# Altium schematic sheet GALX4-0047N_PCB-1109N_REV-A_LCD.SchDoc
size 431 x 279 mm; SheetNumber: 1; SheetTotal: 1; DocumentName: Sheet1.SCHDOC
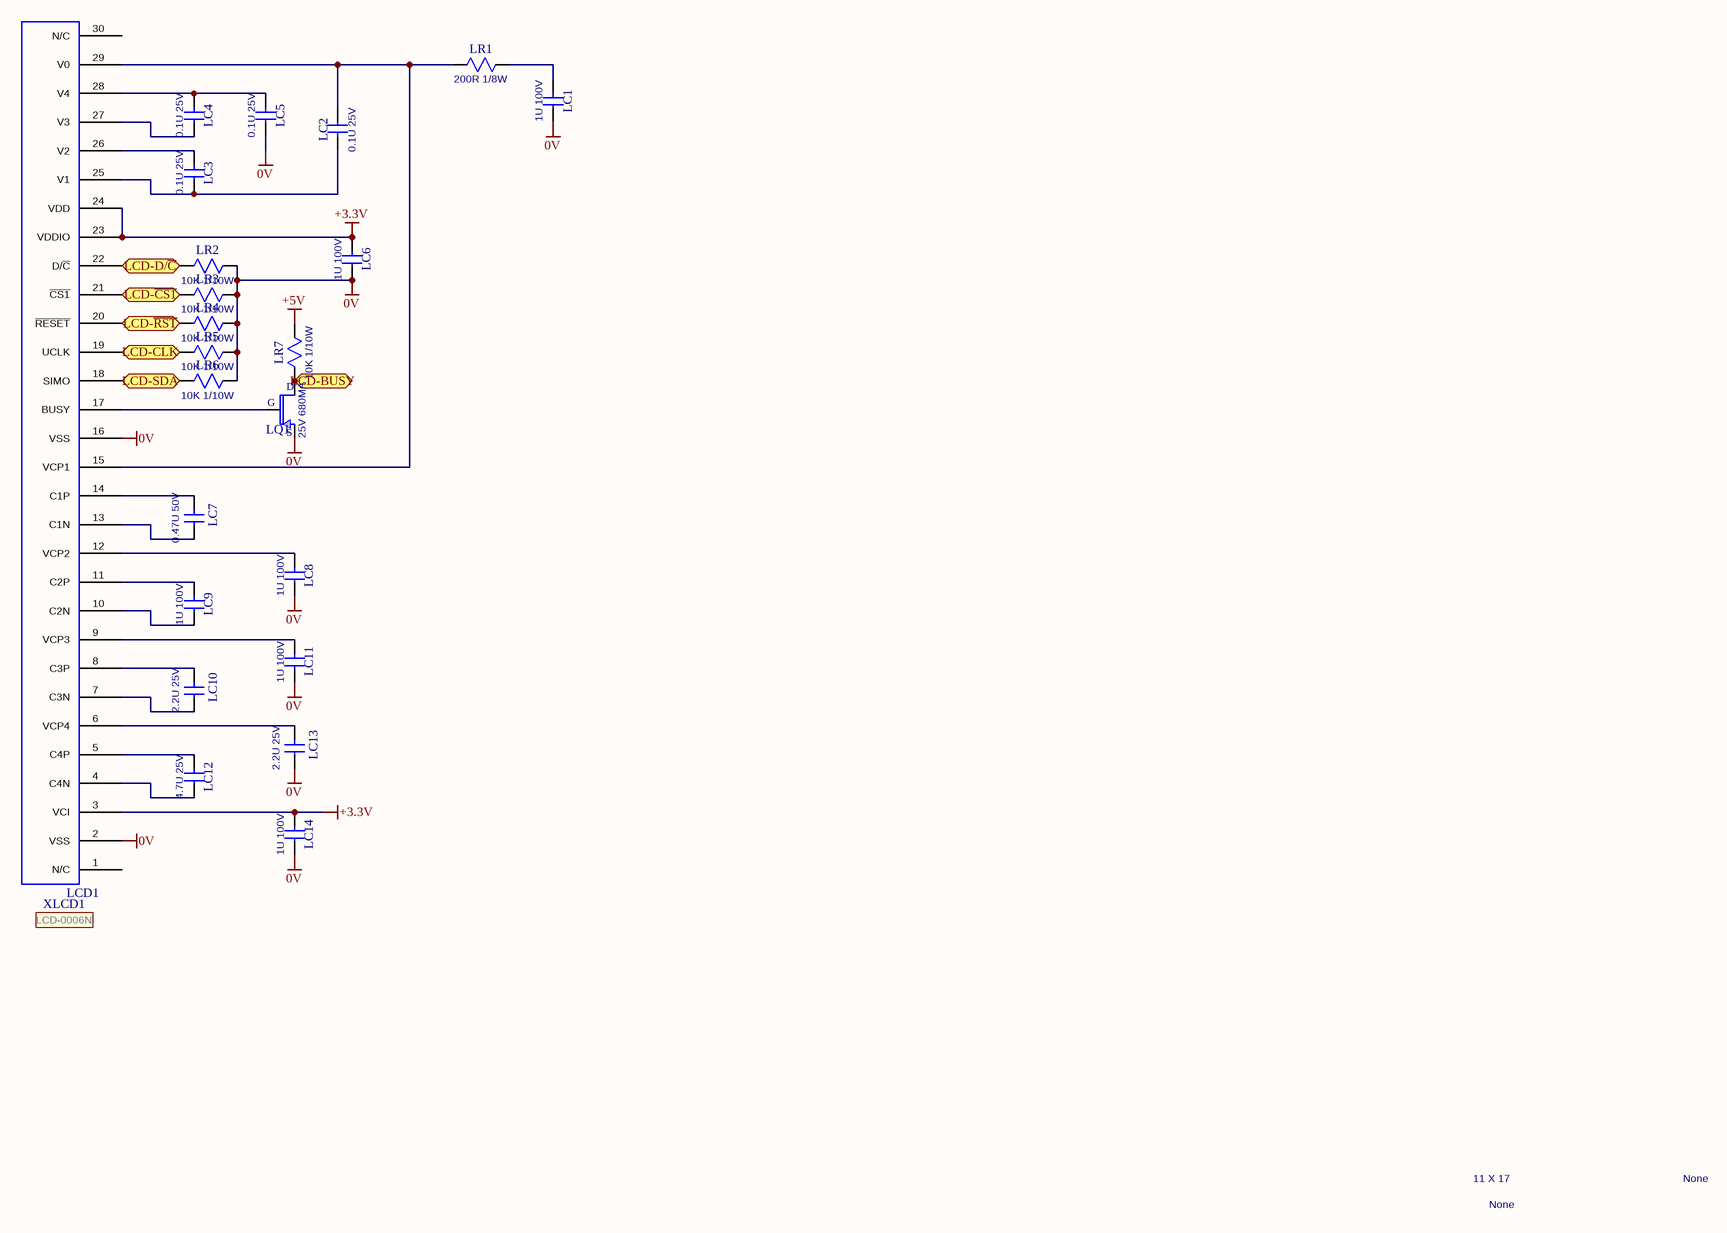
[diagram p0: GALX4-0047N_PCB-1109N_REV-A_LCD.SchDoc]

## Parts
LC1  value 1U 100V  [1206]  (hidden comment: CAP-0110N)
LC2  value 0.1U 25V  [0603]  (hidden comment: CAP-0112N)
LC3  value 0.1U 25V  [0603]  (hidden comment: CAP-0112N)
LC4  value 0.1U 25V  [0603]  (hidden comment: CAP-0112N)
LC5  value 0.1U 25V  [0603]  (hidden comment: CAP-0112N)
LC6  value 1U 100V  [1206]  (hidden comment: CAP-0110N)
LC7  value 0.47U 50V  [0805]  (hidden comment: CAP-0123N)
LC8  value 1U 100V  [1206]  (hidden comment: CAP-0110N)
LC9  value 1U 100V  [1206]  (hidden comment: CAP-0110N)
LC10  value 2.2U 25V  [0805]  (hidden comment: CAP-0124N)
LC11  value 1U 100V  [1206]  (hidden comment: CAP-0110N)
LC12  value 4.7U 25V  [0805]  (hidden comment: CAP-0098N)
LC13  value 2.2U 25V  [0805]  (hidden comment: CAP-0124N)
LC14  value 1U 100V  [1206]  (hidden comment: CAP-0110N)
LCD1  CONN-0278N  [LCD-KENT-120X33-NOTIT]  (value not drawn)
LQ1  value 25V 680MA  [SOT-23]  (hidden comment: XTOR-0020N)
LR1  value 200R 1/8W  [0805]  (hidden comment: RES-0332N)
LR2  value 10K 1/10W  [0603]  (hidden comment: RES-0314N)
LR3  value 10K 1/10W  [0603]  (hidden comment: RES-0314N)
LR4  value 10K 1/10W  [0603]  (hidden comment: RES-0314N)
LR5  value 10K 1/10W  [0603]  (hidden comment: RES-0314N)
LR6  value 10K 1/10W  [0603]  (hidden comment: RES-0314N)
LR7  value 10K 1/10W  [0603]  (hidden comment: RES-0314N)
XLCD1  LCD-0006N  (mechanical)

## Ports
LCD-BUSY (bidir), LCD-CLK (bidir), LCD-D/~{C} (bidir), LCD-SDA (bidir), LCD-~{CS1} (bidir), LCD-~{RST} (bidir)

## Nets
0V: LC1.2(B) LC5.2(B) LC6.2(B) LC8.2(B) LC11.2(B) LC13.2(B) LC14.2(B) LCD1.2(VSS) LCD1.16(VSS) LQ1.3(S) LR2.2 LR3.2 LR4.2 LR5.2 LR6.2
+3.3V: LC6.1(A) LC14.1(A) LCD1.3(VCI) LCD1.23(VDDIO) LCD1.24(VDD)
+5V: LR7.2
LCD-BUSY: LQ1.2(D) LR7.1 ; port LCD-BUSY
LCD-~{CS1}: LCD1.21(~{CS1}) LR3.1 ; port LCD-~{CS1}
LCD-CLK: LCD1.19(UCLK) LR5.1 ; port LCD-CLK
LCD-D/~{C}: LCD1.22(D/~{C}) LR2.1 ; port LCD-D/~{C}
LCD-~{RST}: LCD1.20(~{RESET}) LR4.1 ; port LCD-~{RST}
LCD-SDA: LCD1.18(SIMO) LR6.1 ; port LCD-SDA
NetLC1_1: LC1.1(A) LR1.2
NetLC2_1: LC2.1(A) LC3.2(B) LCD1.25(V1)
NetLC2_2: LC2.2(B) LCD1.15(VCP1) LCD1.29(V0) LR1.1
NetLC3_1: LC3.1(A) LCD1.26(V2)
NetLC4_1: LC4.1(A) LC5.1(A) LCD1.28(V4)
NetLC4_2: LC4.2(B) LCD1.27(V3)
NetLC7_1: LC7.1(A) LCD1.14(C1P)
NetLC7_2: LC7.2(B) LCD1.13(C1N)
NetLC8_1: LC8.1(A) LCD1.12(VCP2)
NetLC9_1: LC9.1(A) LCD1.11(C2P)
NetLC9_2: LC9.2(B) LCD1.10(C2N)
NetLC10_1: LC10.1(A) LCD1.8(C3P)
NetLC10_2: LC10.2(B) LCD1.7(C3N)
NetLC11_1: LC11.1(A) LCD1.9(VCP3)
NetLC12_1: LC12.1(A) LCD1.5(C4P)
NetLC12_2: LC12.2(B) LCD1.4(C4N)
NetLC13_1: LC13.1(A) LCD1.6(VCP4)
NetLCD1_17: LCD1.17(BUSY) LQ1.1(G)

Not connected (* = marked no-connect by the designer): LCD1 1(N/C) 30(N/C)

## Notes on the sheet
- 11 X 17
- None
- TITLE:
- S
- DWG BY
- E
- L
- V
- A
- T
- O
- R
- D
- I
- C
- 50 EAST 153rd STREET
- ENGINEER
- DWG. No.
- BRONX, N.Y. 10451
- REV
- DESCRIPTION
- ECN NO.
- DATE
- SIZE
- SCALE
- PART No.
- FILE NAME
- SHEET __ 0F __
- REV.

## Library data of the parts
LC1 LC6 LC8 LC9 LC11 LC14 = CAP-0110N: C-1206-D-1U-100V-10%; MANUFACTURER: MURATA; MFG PART ID: GRM31CR72A105KA01L; GAL DESC.: CAP, 1UF 100V 10% X7R CERM 1206 SMT; PLACE: S; UNIT $: $0.1400; GAL P/N: CAP-0110N; PART TYPE: 1206POL; VENDOR: *; VENDOR ID: *
LC2-LC5 = CAP-0112N: C-0603-D-0.1U-25V-10%; MANUFACTURER: KEMET; MFG PART ID: C0603C104K3RACTU; GAL DESC.: CAP, 0.1UF 25V 10% CERM 0603 SMT; PLACE: S; UNIT $: $0.0087; GAL P/N: CAP-0112N; PART TYPE: 0603-020; VENDOR: *; VENDOR ID: *
LC7 = CAP-0123N: C-0805-D-0.47U-50V-10%; MANUFACTURER: MURATA; MFG PART ID: GRM21BR71H474KA88L; GAL DESC.: CAP,0.47UF 50V X7R CERM 0805 SMT; PLACE: S; UNIT $: $0.0530; GAL P/N: CAP-0123N; PART TYPE: 0805-050; VENDOR: *; VENDOR ID: *
LC10 LC13 = CAP-0124N: C-0805-D-2.2U-25V-10%; MANUFACTURER: PANASONIC-ECG; MFG PART ID: ECJ-2FB1E225K; GAL DESC.: CAP,2.2UF 25V X5R CERM 0805 SMT; PLACE: S; UNIT $: $0.0658; GAL P/N: CAP-0124N; PART TYPE: 0805-050; VENDOR: *; VENDOR ID: *
LC12 = CAP-0098N: C-0805-D-4.7U-25V-10%; MANUFACTURER: MURATA; MFG PART ID: GRM21BR61E475KA12L; GAL DESC.: CAP 4.7UF 25V 10% CERM 0805 SMT; PLACE: S; UNIT $: $0.0520; GAL P/N: CAP-0098N; PART TYPE: 0805-050; VENDOR: *; VENDOR ID: *
LCD1 = CONN-0278N: FLEX-CABLE-30POS-0.5MM; MANUFACTURER: HIROSE; MFG PART ID: FH12S-30S-0.5SH(55); UNIT $: $0.5800; PLACE: S; GAL DESC.: CONN,FLEX CBL CONN BOT CNTCT 30POS 0.5MM; VENDOR: *; PART TYPE: CONN-0278N; GAL P/N: CONN-0278N; VENDOR ID: *
LQ1 = XTOR-0020N: NMOS-25V-680MA-SOT23; MANUFACTURER: FAIRCHILD SEMI; MFG PART ID: FDV303N; GAL DESC.: MOSFET, N-CH 25V 680MA SOT23 SMT; PLACE: S; UNIT $: $0.0760; GAL P/N: XTOR-0020N; PART TYPE: SOT23; VENDOR: *; VENDOR ID: *
LR1 = RES-0332N: R-0805-A-200R-1/8-5%; MANUFACTURER: VISHAY/DALE; MFG PART ID: CRCW0805200RJNEA; PLACE: S; GAL DESC.: RES,200OHM 1/8W 5% 0805 SMT; UNIT $: $0.0038; GAL P/N: RES-0332N; PART TYPE: 0805; VENDOR: *; VENDOR ID: *
LR2-LR7 = RES-0314N: R-0603-B-10.0K-1/10-5%; MANUFACTURER: PANASONIC-ECG; MFG PART ID: ERJ-3GEYJ103V; PLACE: S; GAL DESC.: RES, 10.0KOHM 1/10W 5% 0603 SMT; UNIT $: $0.0024; GAL P/N: RES-0314N; PART TYPE: 0603; VENDOR: *; VENDOR ID: *
XLCD1 = LCD-0006N: LCD,EPAPER 119X33PX BISTABLE BLUE/WHITE; MANUFACTURER: KENT DISPLAYS INC; MFG PART ID: 01600006301; UNIT $: $5.5000; PLACE: PW; Z-NOTES: STICK DOWN WITH TAPE/GLUE; VENDOR: *; PART TYPE: LCD; VENDOR ID: *; GAL DESC.: LCD,EPAPER 119X33PX BISTABLE BLUE/WHITE; GAL P/N: LCD-0006N